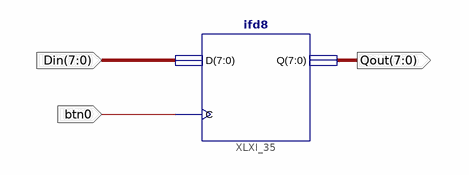
[diagram p0: schematic sheet 1]
// Xilinx ISE schematic top_layer.sch (spartan3e) as structural Verilog: 1 symbols, 3 ports
module top_layer (
  input  btn0,
  input  [7:0] Din,
  output [7:0] Qout
);

  ifd8 XLXI_35 (.C(btn0), .D(Din), .Q(Qout));
endmodule
